# Altium schematic sheet 25_USB_OTG.SchDoc: P30L
size A3; Organization: 六零加智能科技; Address4: www.nidone.com.cn; DocumentNumber: kang jin; Revision: 1.0; SheetNumber: 17; SheetTotal: 23
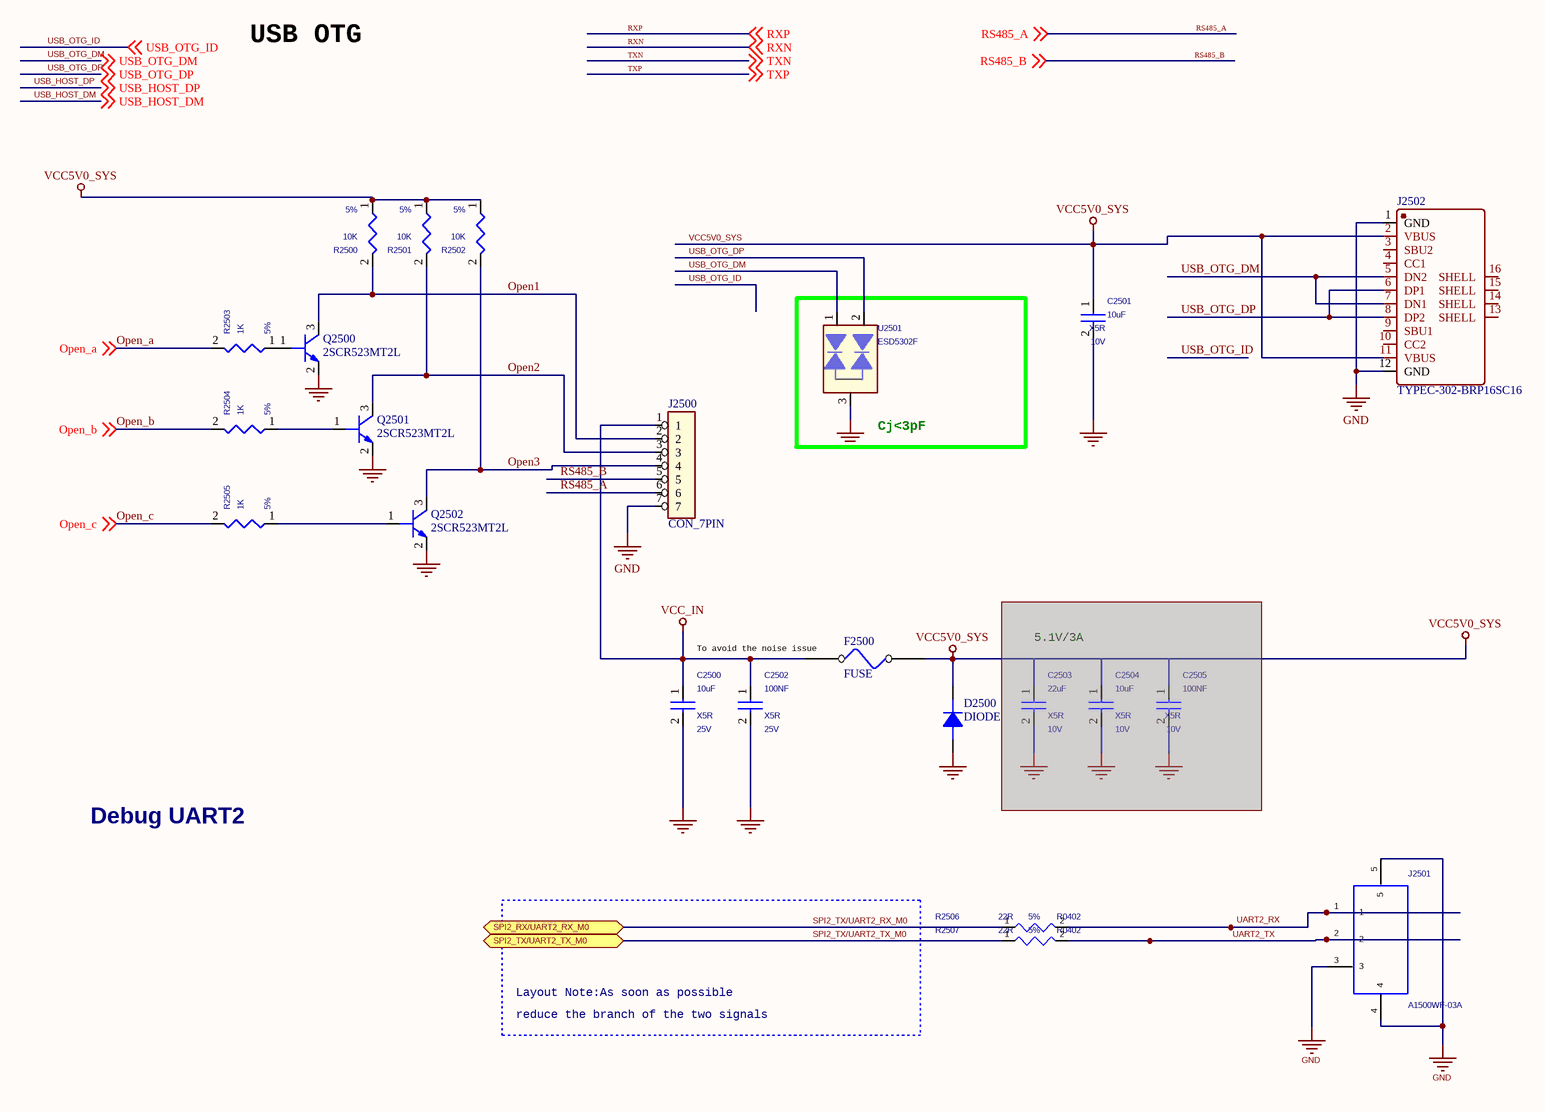
[diagram p0: 25_USB_OTG.SchDoc]

## Parts
C2500  10uF  Voltage: 25V  Dielectric: X5R  [C0805]
C2501  10uF  Voltage: 10V  Dielectric: X5R  [C0603]
C2502  100NF  Voltage: 25V  Dielectric: X5R  [C0402]
C2503  22uF  Voltage: 10V  Dielectric: X5R  [C0805]  (masked out: inside a compile mask, not in the netlist)
C2504  10uF  Voltage: 10V  Dielectric: X5R  [C0805]  (masked out: inside a compile mask, not in the netlist)
C2505  100NF  Voltage: 10V  Dielectric: X5R  [C0402]  (masked out: inside a compile mask, not in the netlist)
D2500  DIODE  [C0805]
F2500  FUSE  [R0805]
J2500  CON_7PIN  [CON_7PIN]
J2501  A1500WF-03A  [TP3]
J2502  TYPEC-302-BRP16SC16  [Type_c]
Q2500  2SCR523MT2L  [SOT-723_L1.2-W0.8-P0.40-LS1.2-BR]
Q2501  2SCR523MT2L  [SOT-723_L1.2-W0.8-P0.40-LS1.2-BR]
Q2502  2SCR523MT2L  [SOT-723_L1.2-W0.8-P0.40-LS1.2-BR]
R2500  10K  Tolerance: 5%  [R0402]
R2501  10K  Tolerance: 5%  [R0402]
R2502  10K  Tolerance: 5%  [R0402]
R2503  1K  Tolerance: 5%  [R0402]
R2504  1K  Tolerance: 5%  [R0402]
R2505  1K  Tolerance: 5%  [R0402]
R2506  value 22R  Tolerance: 5%  [R0402]  (hidden comment: RESISTOR)
R2507  value 22R  Tolerance: 5%  [R0402]  (hidden comment: RESISTOR)
U2501  ESD5302F  [SOT23]

## Blocks framed on the sheet
Cj<3pF: U2501

## Ports
SPI2_RX/UART2_RX_M0 (bidir), SPI2_TX/UART2_TX_M0 (bidir)

## Nets
GND: C2500.2 C2501.2 C2502.2 D2500.1(A) J2500.7 J2501.3 J2501.4 J2501.5 J2502.1(GND) J2502.12(GND) Q2500.2(EMITTER) Q2501.2(EMITTER) Q2502.2(EMITTER) U2501.3
VCC5V0_SYS: C2501.1 D2500.2(K) F2500.2 J2502.2(VBUS) J2502.11(VBUS) R2500.1 R2501.1 R2502.1
VCC_IN: C2500.1 C2502.1 F2500.1 J2500.1
Open1: J2500.2 Q2500.3(COLLECTOR) R2500.2
Open2: J2500.3 Q2501.3(COLLECTOR) R2501.2
Open3: J2500.4 Q2502.3(COLLECTOR) R2502.2
Open_a: R2503.2 ; off-sheet Open_a
Open_b: R2504.2 ; off-sheet Open_b
Open_c: R2505.2 ; off-sheet Open_c
RS485_A: J2500.6 ; off-sheet RS485_A
RS485_B: J2500.5 ; off-sheet RS485_B
RXN: off-sheet RXN
RXP: off-sheet RXP
SPI2_TX/UART2_RX_M0: R2506.1 ; port SPI2_RX/UART2_RX_M0
SPI2_TX/UART2_TX_M0: R2507.1 ; port SPI2_TX/UART2_TX_M0
TXN: off-sheet TXN
TXP: off-sheet TXP
UART2_TX: J2501.2 R2507.2
USB_HOST_DM: off-sheet USB_HOST_DM
USB_HOST_DP: off-sheet USB_HOST_DP
USB_OTG_DM: J2502.5(DN2) J2502.7(DN1) U2501.1 ; off-sheet USB_OTG_DM
USB_OTG_DP: J2502.6(DP1) J2502.8(DP2) U2501.2 ; off-sheet USB_OTG_DP
USB_OTG_ID: off-sheet USB_OTG_ID
NetJ2501_1: J2501.1 R2506.2
NetQ2500_1: Q2500.1(BASE) R2503.1
NetQ2501_1: Q2501.1(BASE) R2504.1
NetQ2502_1: Q2502.1(BASE) R2505.1

Not connected (* = marked no-connect by the designer): J2502 3(SBU2) 4(CC1) 9(SBU1) 10(CC2) 13(SHELL) 14(SHELL) 15(SHELL) 16(SHELL)

## Notes on the sheet
- USB OTG
- To avoid the noise issue
- 5.1V/3A
- Debug UART2
- Layout Note:As soon as possible
- reduce the branch of the two signals
- Labels drawn without touching a wire or pin: UART2_RX
- Title
- Size:
- Date:
- A3
- Engineer:
- Time:
- Revision:
- Sheet
- of
- File:

## Library data of the parts
C2500 = CAP NP_Dup1: cap,10.00uF,+/-10%,25V,X5R,C0805; Manufacturer PN: C2012X5R1E106K085AC; Manufacturer: TDK; Tolerance: 10%; Priority: A; Created by: JJJ; Part Type: C0805; RK PN: C2012X5R1E106K085AC
C2501 = CAP NP_Dup1: cap,10.00uF,+/-10%,10V,X5R,C0603; Manufacturer: TDK; RK PN: C1608X5R1A106K080AC; Priority: A; Tolerance: 10%; Part Type: C0603; Manufacturer PN: C1608X5R1A106K080AC; Created by: JJJ
C2502 = CAP NP_Dup1: cap,100.00nF,+/-10%,25V,X5R,C0402; Manufacturer: TDK; RK PN: C1005X5R1E104K050BC; Priority: A; Tolerance: 10%; Part Type: C0402; Manufacturer PN: C1005X5R1E104K050BC; Created by: JJJ
C2503 = CAP NP_Dup1: cap,22.00uF,+/-10%,10V,X5R,C0805; Manufacturer PN: C2012X5R1A226K125AB; Manufacturer: TDK; Tolerance: 10%; Priority: A; Created by: JJJ; Part Type: C0805; RK PN: C2012X5R1A226K125AB
C2504 = CAP NP_Dup1: cap,10.00uF,+/-10%,10V,X5R,C0805; Manufacturer: TDK; RK PN: C2012X5R1A106K125AB; Priority: A; Tolerance: 10%; Part Type: C0805; Manufacturer PN: C2012X5R1A106K125AB; Created by: JJJ
C2505 = CAP NP_Dup1: cap,100.00nF,+/-10%,10V,X5R,C0402; Manufacturer PN: C0603X5R1A104K030BC; Manufacturer: TDK; Tolerance: 10%; Priority: A; Created by: JJJ; Part Type: C0402; RK PN: C0603X5R1A104K030BC
J2501 = A1500WF-03A: ZH1.5卧贴针座3PIN; Manufacturer_PN: HZ1515103N5200; PCB DECAL: ZH1.5-3P; Number: 1
J2502 = Type-c
Q2500-Q2502 = NPN
R2500-R2502 = RESISTOR_Dup1: 通用厚膜电阻,10K,+/-5%,R0402,1/16W.; Manufacturer PN: RC0402JR-072KL; Manufacturer: YAGEO; Wattage: 1/16W; Priority: A; Created by: YTL; Part Type: 通用厚膜电阻; RK PN: RC0402JR-072KL
R2503-R2505 = RESISTOR_Dup1: 通用厚膜电阻,1K,+/-5%,R0402,1/16W.; Manufacturer PN: RC0402JR-072KL; Manufacturer: YAGEO; Wattage: 1/16W; Priority: A; Created by: YTL; Part Type: 通用厚膜电阻; RK PN: RC0402JR-072KL
R2506 = RESISTOR: ?用厚膜电阻,22R,+/-5%,R0402,1/16W.; Manufacturer_PN: RC0402JR-0722RL; Manufacturer: YAGEO; Created_by: YTL; Wattage: 1/16W; Priority: A; Source_Path: Z:\RK_STANDARD_LIBRARY\CADENCE_CIS\RK_DISCRETE.OLB; number: 1; PCB DECAL: R0402; Part_Type: ?用厚膜电阻; RK_PN: RC0402JR-0722RL
R2507 = RESISTOR: ?用厚膜电阻,22R,+/-5%,R0402,1/16W.; Manufacturer: YAGEO; RK_PN: RC0402JR-0722RL; Priority: A; Wattage: 1/16W; Created_by: YTL; Source_Path: Z:\RK_STANDARD_LIBRARY\CADENCE_CIS\RK_DISCRETE.OLB; number: 1; PCB DECAL: R0402; Part_Type: ?用厚膜电阻; Manufacturer_PN: RC0402JR-0722RL
U2501 = ESD_ESDA6V8UL: 2-Lines, Uni-directional,Ultra-low Capacitance.Transient Voltage Suppressors; Manufacturer: WillSemi(韦尔半导体); Priority: A; RK PN: ESD5302F; Part Type: ESD_TVS; Manufacturer PN: ESD5302F; Created by: JJJ